# Altium project Dual_P_Variable_Power_Supply.PrjPcb
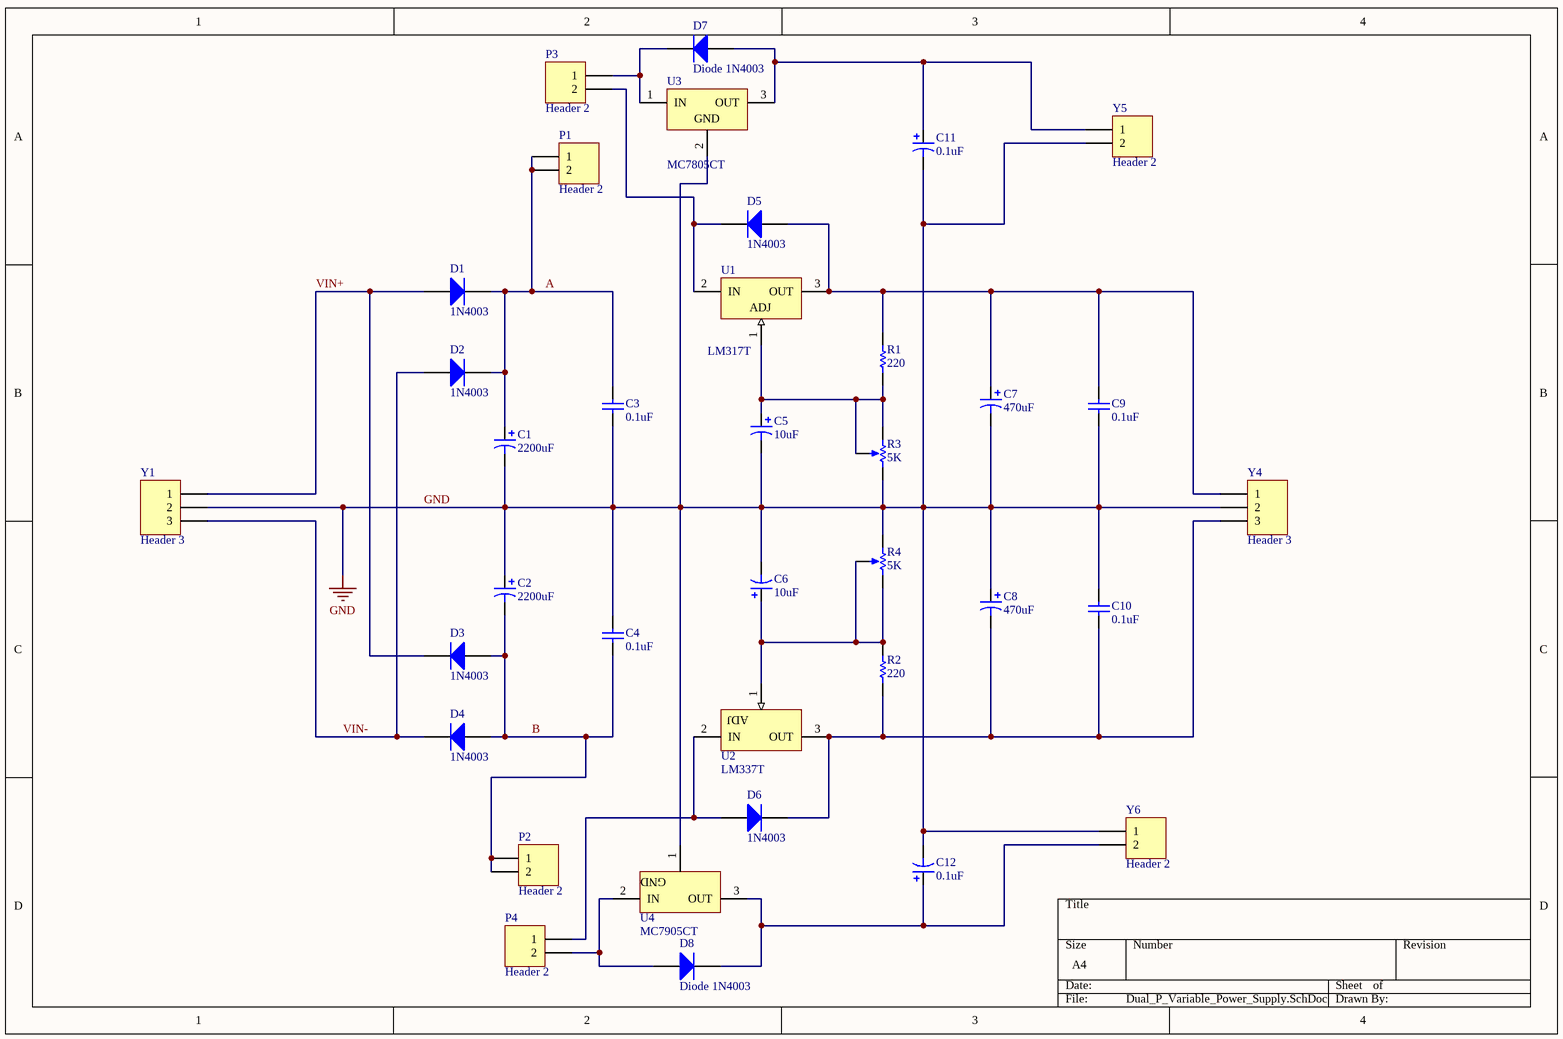
[diagram p0: Dual_P_Variable_Power_Supply.SchDoc]
1 sheet, 36 parts. Net scope: global (net labels, ports and power ports of the same name join across sheets).
Board file: Dual_P_Variable_Power_Supply.PcbDoc

## Sheet Dual_P_Variable_Power_Supply.SchDoc
size A4

### Parts
C1  2200uF  [RB7.6-15]
C2  2200uF  [RB7.6-15]
C3  0.1uF  [RAD-0.3]
C4  0.1uF  [RAD-0.3]
C5  10uF  [RB7.6-15]
C6  10uF  [RB7.6-15]
C7  470uF  [RB7.6-15]
C8  470uF  [RB7.6-15]
C9  0.1uF  [RAD-0.3]
C10  0.1uF  [RAD-0.3]
C11  0.1uF  [RB7.6-15]
C12  0.1uF  [RB7.6-15]
D1  1N4003  [DO-41]
D2  1N4003  [DO-41]
D3  1N4003  [DO-41]
D4  1N4003  [DO-41]
D5  1N4003  [DO-41]
D6  1N4003  [DO-41]
D7  Diode 1N4003  [DO-41]
D8  Diode 1N4003  [DO-41]
P1  Header 2  [HDR1X2]
P2  Header 2  [HDR1X2]
P3  Header 2  [HDR1X2]
P4  Header 2  [HDR1X2]
R1  220  [AXIAL-0.3]
R2  220  [AXIAL-0.3]
R3  5K  [VR5]
R4  5K  [VR5]
U1  LM317T  [TO220ABN]
U2  LM337T  [221A-04]
U3  MC7805CT  [221A-04]
U4  MC7905CT  [221A-04]
Y1  Header 3  [HDR1X3]
Y4  Header 3  [HDR1X3]
Y5  Header 2  [HDR1X2]
Y6  Header 2  [HDR1X2]

### Nets
GND: C1.2 C2.1 C3.1 C4.2 C5.2 C6.2 C7.2 C8.1 C9.1 C10.2 C11.2 C12.2 R3.2(BOT) R4.1(TOP) U3.2(GND) U4.1(GND) Y1.2 Y4.2 Y5.2 Y6.1
A: C1.1 C3.2 D1.2(K) D2.2(K) P1.1 P1.2
B: C2.2 C4.1 D3.1(A) D4.1(A) P2.1 P2.2
VIN+: D1.1(A) D3.2(K) Y1.1
VIN-: D2.1(A) D4.2(K) Y1.3
NetC5_1: C5.1 R1.1 R3.1(TOP) R3.3(TAP) U1.1(ADJ)
NetC6_1: C6.1 R2.2 R4.2(BOT) R4.3(TAP) U2.1(ADJ)
NetC7_1: C7.1 C9.2 D5.1(A) R1.2 U1.3(OUT) Y4.1
NetC8_2: C8.2 C10.1 D6.2(K) R2.1 U2.3(OUT) Y4.3
NetC11_1: C11.1 D7.1(A) U3.3(OUT) Y5.1
NetC12_1: C12.1 D8.2(K) U4.3(OUT) Y6.2
NetD5_2: D5.2(K) P3.2 U1.2(IN)
NetD6_1: D6.1(A) P4.1 U2.2(IN)
NetD7_2: D7.2(K) P3.1 U3.1(IN)
NetD8_1: D8.1(A) P4.2 U4.2(IN)

### Notes on the sheet
- (near U1) The in and out are assigned to different pin numbers in original schematic
- (near R4) There is question in the way the Potentiometer's pins are connected?

### Library data of the parts
C1 C2 C5-C8 = Cap Pol1: Polarized Capacitor (Radial); Voltage: 35V; Published: 8-Jun-2000; LatestRevisionDate: 17-Jul-2002; LatestRevisionNote: Re-released for DXP Platform.; PackageReference: RB7.6-15; Publisher: Altium Limited; PackageDescription: Polarized Capacitor (Radial); 2 Leads
  C1 C2: Value: 2200uF
  C5 C6: Value: 10uF
  C7 C8: Value: 470uF
C3 C4 C9 C10 = Cap: Capacitor; Voltage: 50V; Published: 8-Jun-2000; LatestRevisionDate: 17-Jul-2002; LatestRevisionNote: Re-released for DXP Platform.; PackageReference: RAD-0.3; Publisher: Altium Limited; PackageDescription: Radial Cap, Thru-Hole; 2 Leads; 0.3 in Pin Spacing; Value: 0.1uF
C11 C12 = Cap Pol1: Polarized Capacitor (Radial); Published: 8-Jun-2000; LatestRevisionDate: 17-Jul-2002; LatestRevisionNote: Re-released for DXP Platform.; PackageReference: RB7.6-15; Publisher: Altium Limited; PackageDescription: Polarized Capacitor (Radial); 2 Leads; Value: 0.1uF
D1-D8 = Diode 1N4003: 1 Amp General Purpose Rectifier; Published: 8-Jun-2000; LatestRevisionDate: 17-Jul-2002; LatestRevisionNote: Re-released for DXP Platform.; DatasheetVersion: 1998; PackageVersion: Aug-1999; PackageReference: DO-41; Publisher: Altium Limited; PackageDescription: Diode, Axial; Body 5.2 x 2.7 mm (LxDia. max), Lead Dia. 0.86 mm (max); Code_JEDEC: DO-204-AL; ComponentLink1Description: Manufacturer Link; ComponentLink1URL: http://www.fairchildsemi.com/; ComponentLink2Description: Datasheet; ComponentLink2URL: http://www.fairchildsemi.com/ds/1N%2F1N4001.pdf
P1-P4 Y5 Y6 = Header 2: Header, 2-Pin; LatestRevisionDate: 17-Jul-2002; LatestRevisionNote: Re-released for DXP Platform.; Publisher: Altium Limited
R1 R2 = Res1: Resistor; Published: 8-Jun-2000; LatestRevisionDate: 17-Jul-2002; LatestRevisionNote: Re-released for DXP Platform.; PackageReference: AXIAL-0.3; Publisher: Altium Limited; PackageDescription: Axial Device, Thru-Hole; 2 Leads; 0.3 in Pin Spacing; Value: 220
R3 R4 = RPot: Potentiometer; Sim Note: Enter the Resistance value and the set point into parameter fields.; Set Position: 0.5; Published: 8-Jun-2000; LatestRevisionDate: 17-Jul-2002; LatestRevisionNote: Re-released for DXP Platform.; PackageReference: VR5; Publisher: Altium Limited; PackageDescription: Variable Resistor, Thru-Hole; 3 Leads; Value: 5K
U1 = LM317T: 1.2V to 37V Voltage Regulator; Note: Tab is connected to pin 3 (OUT).; Published: 24-Aug-2001; LatestRevisionDate: 17-Jul-2002; LatestRevisionNote: Re-released for DXP Platform.; DatasheetVersion: Nov-1999; PackageVersion: Jun-1998; PackageReference: TO220ABN; Publisher: Altium Limited; PackageDescription: TO, Thru-Hole, Vertical, Heatsink Mounted; 3 In-Line Leads; Pitch 2.54 mm; Pin sequence 1, 3, 2; ComponentLink1Description: Manufacturer Link; ComponentLink1URL: http://www.st.com/; ComponentLink2Description: Datasheet; ComponentLink2URL: http://www.st.com/stonline/products/literature/ds/2154/lm117.pdf
U2 = LM337T: 3-Terminal Adjustable Negative Voltage Regulator; Note: Heatsink surface connected to pin 2.; Published: 17-Jul-2002; DatasheetVersion: 1988; PackageReference: 221A-04; Publisher: Altium Limited; PackageDescription: TO, Thru-Hole, Vertical, Heatsink Mounted; 3 In-Line Leads; Pitch 2.54 mm; Code_JEDEC: TO-262-AA; ComponentLink1Description: Manufacturer Link; ComponentLink1URL: http://www.onsemi.com/site/products/taxonomy/0,4438,503,00.html
U3 = MC7805CT: 3-Terminal Positive Fixed Voltage Regulator; Note: Pin 2 is electrically connected to TAB; Published: 17-Jul-2002; DatasheetVersion: 1988; PackageReference: 221A-04; Publisher: Altium Limited; PackageDescription: TO, Thru-Hole, Vertical, Heatsink Mounted; 3 In-Line Leads; Pitch 2.54 mm; Code_JEDEC: TO-262-AA; ComponentLink1Description: Manufacturer Link; ComponentLink1URL: http://www.onsemi.com/site/products/taxonomy/0,4438,503,00.html; ComponentLink2Description: Datasheet; ComponentLink2URL: http://www.onsemi.com/pub/Collateral/MC7800-D.PDF
U4 = MC7905CT: Three-Terminal Negative Fixed Voltage Regulator; Note: Heatsink suface connected to pin 2.; Published: 17-Jul-2002; DatasheetVersion: 1988; PackageReference: 221A-04; Publisher: Altium Limited; PackageDescription: TO, Thru-Hole, Vertical, Heatsink Mounted; 3 In-Line Leads; Pitch 2.54 mm; Code_JEDEC: TO-262-AA; ComponentLink1Description: Manufacturer Link; ComponentLink1URL: http://www.onsemi.com/site/products/taxonomy/0,4438,503,00.html; ComponentLink2Description: Datasheet; ComponentLink2URL: http://www.onsemi.com/pub/Collateral/MC7900-D.PDF
Y1 Y4 = Header 3: Header, 3-Pin; LatestRevisionDate: 17-Jul-2002; LatestRevisionNote: Re-released for DXP Platform.; Publisher: Altium Limited